# EAGLE schematic PreContV1 (EAGLE 6.1)
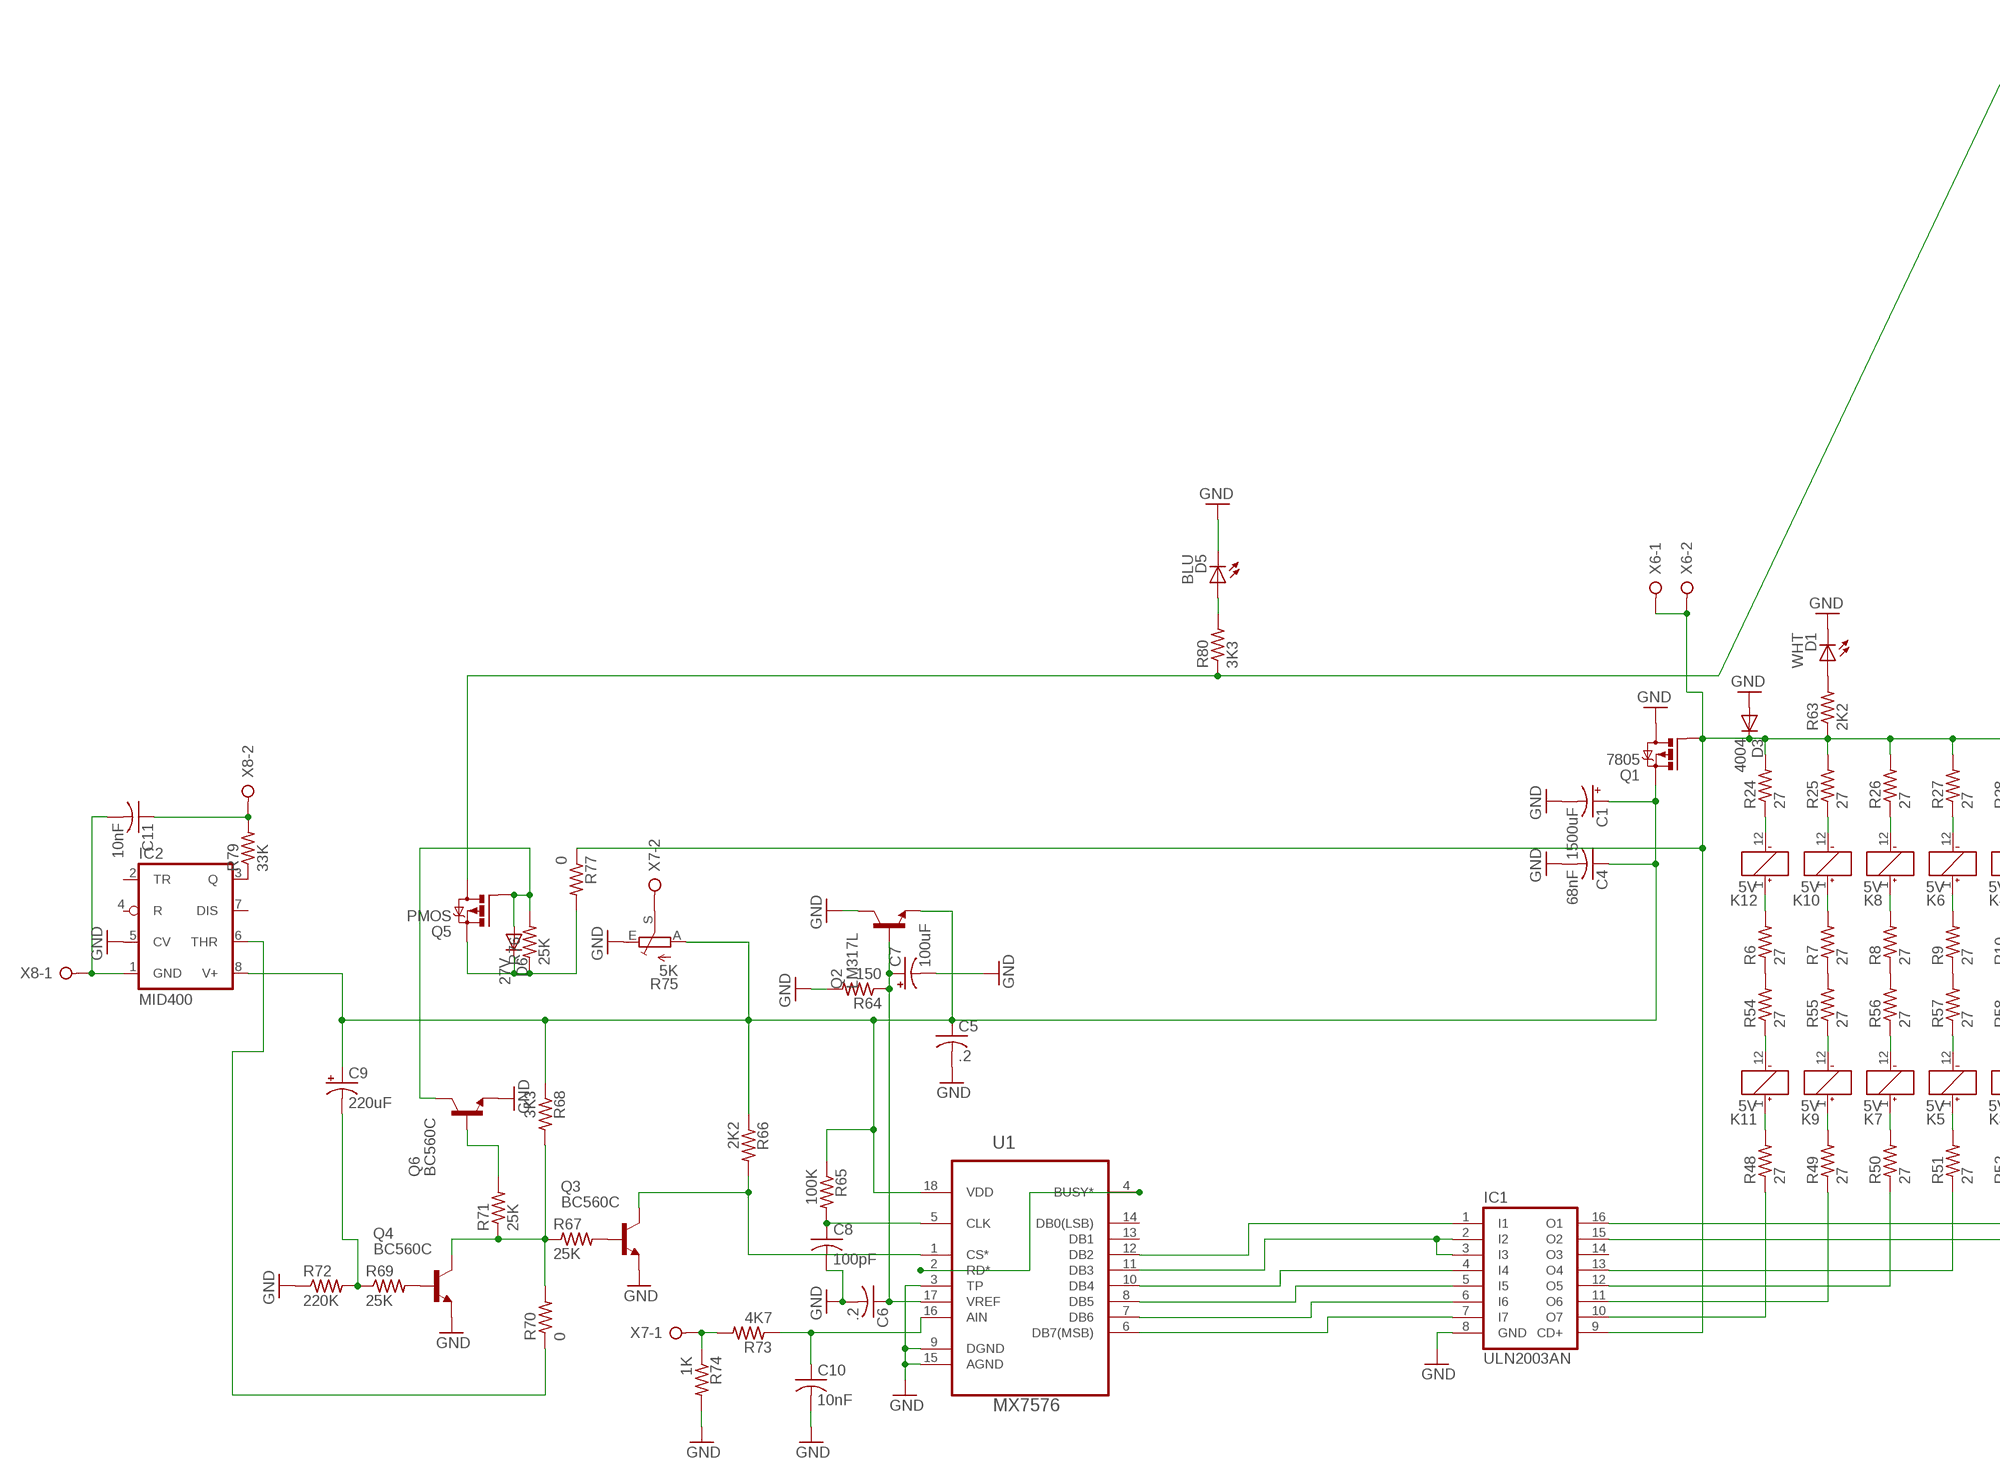
[diagram p0: schematic, sheet 1, part 1 of 2]
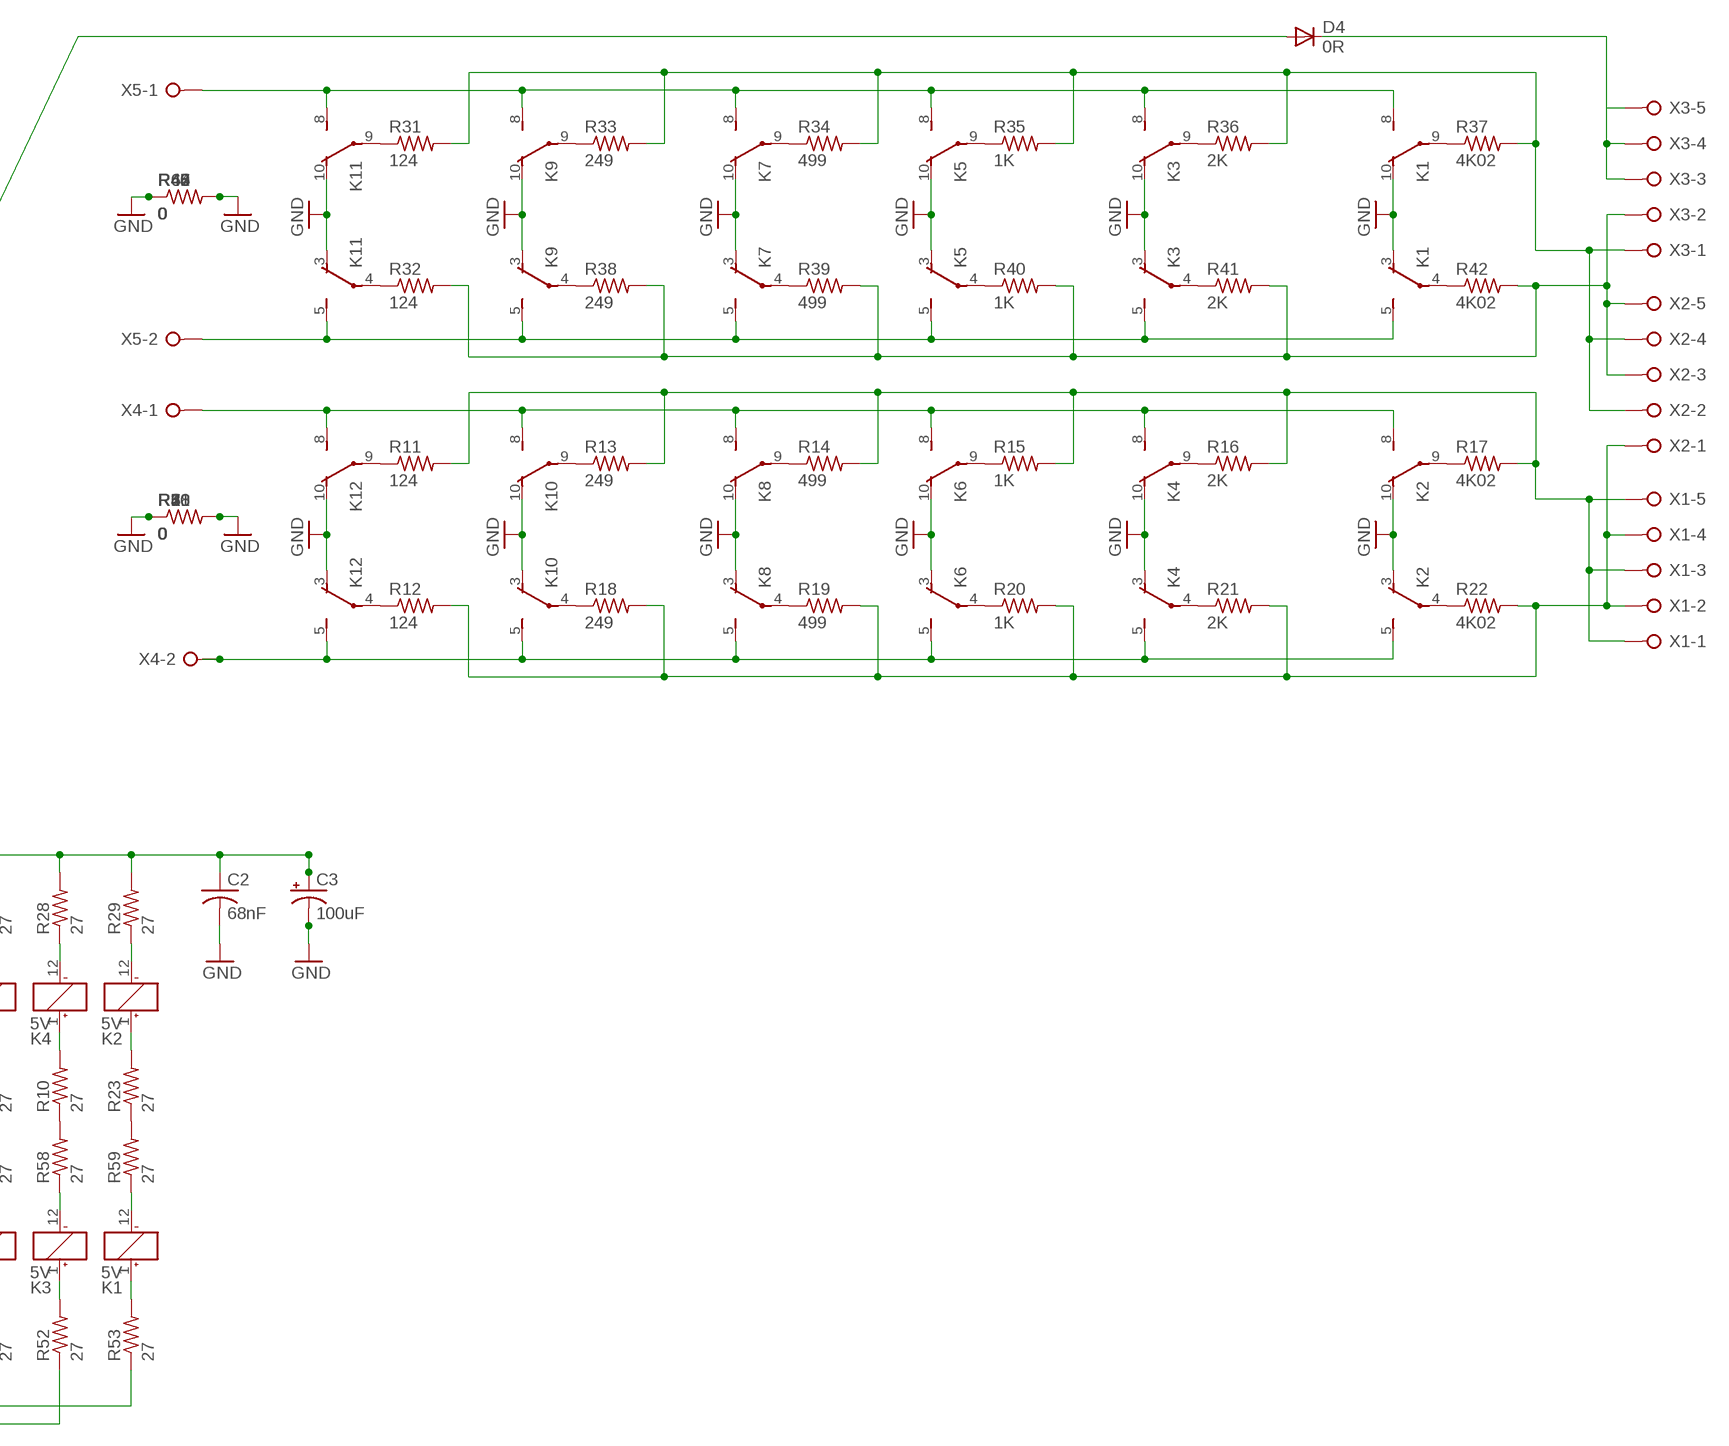
[diagram p1: schematic, sheet 1, part 2 of 2]

## Parts
C1  1500uF  CPOL-USE5-10.5  [E5-10,5]
C2  68nF  C-US075-042X103  [C075-042X103]
C3  100uF  CPOL-USE5-10.5  [E5-10,5]
C4  68nF  C-US075-042X103  [C075-042X103]
C5  .2  C-USC1210K  [C1210K]
C6  .2  C-USC1210K  [C1210K]
C7  100uF  CPOL-USE5-10.5  [E5-10,5]
C8  100pF  C-US050-075X075  [C050-075X075]
C9  220uF  CPOL-USE5-10.5  [E5-10,5]
C10  10nF  C-US050-075X075  [C050-075X075]
C11  10nF  C-US075-042X103  [C075-042X103]
D1  WHT  SFH482  [SFH482]
D3  4004  1N4148DO35-10  [DO35-10]
D4  0R  1N4148DO35-10  [DO35-10]
D5  BLU  SFH482  [SFH482]
D6  27V  1N4148DO35-7  [DO35-7]
IC1  ULN2003AN  [DIL16]
IC2  MID400  LM555N  [DIL08]
K1  5V  TX2-12V  [TX2]
K2  5V  TX2-12V  [TX2]
K3  5V  TX2-12V  [TX2]
K4  5V  TX2-12V  [TX2]
K5  5V  TX2-12V  [TX2]
K6  5V  TX2-12V  [TX2]
K7  5V  TX2-12V  [TX2]
K8  5V  TX2-12V  [TX2]
K9  5V  TX2-12V  [TX2]
K10  5V  TX2-12V  [TX2]
K11  5V  TX2-12V  [TX2]
K12  5V  TX2-12V  [TX2]
Q1  7805  IRF4905  [TO220BH]
Q2  LM317L  BC550B  [TO92-EBC]
Q3  BC560C  BC550B  [TO92-EBC]
Q4  BC560C  BC550B  [TO92-EBC]
Q5  PMOS  IRF4905  [TO220BH]
Q6  BC560C  BC550B  [TO92-EBC]
R1  0  R-US_0207/10  [0207/10]
R2  0  R-US_0207/10  [0207/10]
R3  0  R-US_0207/10  [0207/10]
R4  0  R-US_0207/10  [0207/10]
R5  0  R-US_0207/10  [0207/10]
R6  27  R-US_0207/10  [0207/10]
R7  27  R-US_0207/10  [0207/10]
R8  27  R-US_0207/10  [0207/10]
R9  27  R-US_0207/10  [0207/10]
R10  27  R-US_0207/10  [0207/10]
R11  124  R-US_0207/10  [0207/10]
R12  124  R-US_0207/10  [0207/10]
R13  249  R-US_0207/10  [0207/10]
R14  499  R-US_0207/10  [0207/10]
R15  1K  R-US_0207/10  [0207/10]
R16  2K  R-US_0207/10  [0207/10]
R17  4K02  R-US_0207/10  [0207/10]
R18  249  R-US_0207/10  [0207/10]
R19  499  R-US_0207/10  [0207/10]
R20  1K  R-US_0207/10  [0207/10]
R21  2K  R-US_0207/10  [0207/10]
R22  4K02  R-US_0207/10  [0207/10]
R23  27  R-US_0207/10  [0207/10]
R24  27  R-US_0207/10  [0207/10]
R25  27  R-US_0207/10  [0207/10]
R26  27  R-US_0207/10  [0207/10]
R27  27  R-US_0207/10  [0207/10]
R28  27  R-US_0207/10  [0207/10]
R29  27  R-US_0207/10  [0207/10]
R30  0  R-US_0207/10  [0207/10]
R31  124  R-US_0207/10  [0207/10]
R32  124  R-US_0207/10  [0207/10]
R33  249  R-US_0207/10  [0207/10]
R34  499  R-US_0207/10  [0207/10]
R35  1K  R-US_0207/10  [0207/10]
R36  2K  R-US_0207/10  [0207/10]
R37  4K02  R-US_0207/10  [0207/10]
R38  249  R-US_0207/10  [0207/10]
R39  499  R-US_0207/10  [0207/10]
R40  1K  R-US_0207/10  [0207/10]
R41  2K  R-US_0207/10  [0207/10]
R42  4K02  R-US_0207/10  [0207/10]
R43  0  R-US_0207/10  [0207/10]
R44  0  R-US_0207/10  [0207/10]
R45  0  R-US_0207/10  [0207/10]
R46  0  R-US_0207/10  [0207/10]
R47  0  R-US_0207/10  [0207/10]
R48  27  R-US_0207/10  [0207/10]
R49  27  R-US_0207/10  [0207/10]
R50  27  R-US_0207/10  [0207/10]
R51  27  R-US_0207/10  [0207/10]
R52  27  R-US_0207/10  [0207/10]
R53  27  R-US_0207/10  [0207/10]
R54  27  R-US_0207/12  [0207/12]
R55  27  R-US_0207/12  [0207/12]
R56  27  R-US_0207/12  [0207/12]
R57  27  R-US_0207/12  [0207/12]
R58  27  R-US_0207/12  [0207/12]
R59  27  R-US_0207/10  [0207/10]
R60  0  R-US_0207/10  [0207/10]
R61  0  R-US_0207/10  [0207/10]
R62  0  R-US_0207/10  [0207/10]
R63  2K2  R-US_0309/12  [0309/12]
R64  150  R-US_0207/10  [0207/10]
R65  100K  R-US_0207/10  [0207/10]
R66  2K2  R-US_0207/10  [0207/10]
R67  25K  R-US_0207/10  [0207/10]
R68  3K3  R-US_0207/10  [0207/10]
R69  25K  R-US_0207/10  [0207/10]
R70  0  R-US_0207/10  [0207/10]
R71  25K  R-US_0207/10  [0207/10]
R72  220K  R-US_0207/10  [0207/10]
R73  4K7  R-US_0207/10  [0207/10]
R74  1K  R-US_0207/10  [0207/10]
R75  5K  TRIM_EU-RJ9W  [RJ9W]
R76  25K  R-US_0207/10  [0207/10]
R77  0  R-US_0207/10  [0207/10]
R78  0  R-US_0207/10  [0207/10]
R79  33K  R-US_0309/12  [0309/12]
R80  3K3  R-US_0207/10  [0207/10]
U1  MX7576  AD7575JNZ  [DIP254P762X533-18P]
X1  W237-05P  [W237-5P]
X2  W237-05P  [W237-5P]
X3  W237-05P  [W237-5P]
X4  W237-02P  [W237-132]
X5  W237-02P  [W237-132]
X6  W237-02P  [W237-132]
X7  W237-02P  [W237-132]
X8  W237-02P  [W237-132]

## Nets
GND: C1.- C2.2 C3.- C4.2 C5.2 C6.2 C7.- C8.2 C10.2 D1.K(C) D3.A D5.K(C) IC1.8(GND) IC2.5(CV) K1.3(1:O) K1.10(2:O) K2.3(1:O) K2.10(2:O) K3.3(1:O) K3.10(2:O) K4.3(1:O) K4.10(2:O) K5.3(1:O) K5.10(2:O) K6.3(1:O) K6.10(2:O) K7.3(1:O) K7.10(2:O) K8.3(1:O) K8.10(2:O) K9.3(1:O) K9.10(2:O) K10.3(1:O) K10.10(2:O) K11.3(1:O) K11.10(2:O) K12.3(1:O) K12.10(2:O) Q1.D Q2.C Q3.E Q4.E Q6.E R1.1 R1.2 R2.1 R2.2 R3.1 R3.2 R4.1 R4.2 R5.1 R5.2 R30.1 R30.2 R43.1 R43.2 R44.1 R44.2 R45.1 R45.2 R46.1 R46.2 R47.1 R47.2 R60.1 R60.2 R61.1 R61.2 R62.1 R62.2 R64.2 R72.1 R74.2 R75.E R78.1 R78.2 U1.3(TP) U1.9(DGND) U1.15(AGND)
N$1: D4.A Q5.D R80.1
N$2: R32.2 R38.2 R39.2 R40.2 R41.2 R42.2 X2.3 X2.5 X3.2
N$3: R31.2 R33.2 R34.2 R35.2 R36.2 R37.2 X2.2 X2.4 X3.1
N$4: K1.8(2:S) K3.8(2:S) K5.8(2:S) K7.8(2:S) K9.8(2:S) K11.8(2:S) X5.1
N$5: K1.5(1:S) K3.5(1:S) K5.5(1:S) K7.5(1:S) K9.5(1:S) K11.5(1:S) X5.2
N$6: K11.9(2:P) R31.1
N$7: K11.4(1:P) R32.1
N$8: K2.8(2:S) K4.8(2:S) K6.8(2:S) K8.8(2:S) K10.8(2:S) K12.8(2:S) X4.1
N$9: K2.5(1:S) K4.5(1:S) K6.5(1:S) K8.5(1:S) K10.5(1:S) K12.5(1:S) X4.2
N$10: R12.2 R18.2 R19.2 R20.2 R21.2 R22.2 X1.2 X1.4 X2.1
N$11: K12.1(_:+) R6.2
N$12: K10.1(_:+) R7.2
N$13: K8.1(_:+) R8.2
N$14: K6.1(_:+) R9.2
N$15: R11.2 R13.2 R14.2 R15.2 R16.2 R17.2 X1.1 X1.3 X1.5
N$16: K4.1(_:+) R10.2
N$17: K2.1(_:+) R23.2
N$18: K12.12(_:-) R24.1
N$19: K10.12(_:-) R25.1
N$20: K12.9(2:P) R11.1
N$21: K12.4(1:P) R12.1
N$22: K10.9(2:P) R13.1
N$23: K8.9(2:P) R14.1
N$24: K6.9(2:P) R15.1
N$25: K2.9(2:P) R17.1
N$26: K4.9(2:P) R16.1
N$27: K10.4(1:P) R18.1
N$28: K8.4(1:P) R19.1
N$29: K6.4(1:P) R20.1
N$30: K4.4(1:P) R21.1
N$31: K2.4(1:P) R22.1
N$32: K8.12(_:-) R26.1
N$33: K6.12(_:-) R27.1
N$34: K4.12(_:-) R28.1
N$35: K2.12(_:-) R29.1
N$36: C2.1 C3.+ D3.C IC1.9(CD+) Q1.G R24.2 R25.2 R26.2 R27.2 R28.2 R29.2 R63.1 R77.1 X6.1 X6.2
N$37: K9.9(2:P) R33.1
N$38: K7.9(2:P) R34.1
N$39: K5.9(2:P) R35.1
N$40: K1.9(2:P) R37.1
N$41: K3.9(2:P) R36.1
N$42: K9.4(1:P) R38.1
N$43: K7.4(1:P) R39.1
N$44: K5.4(1:P) R40.1
N$45: K3.4(1:P) R41.1
N$46: K1.4(1:P) R42.1
N$47: K11.1(_:+) R48.2
N$48: K9.1(_:+) R49.2
N$49: K7.1(_:+) R50.2
N$50: K5.1(_:+) R51.2
N$51: K3.1(_:+) R52.2
N$52: K1.1(_:+) R53.2
N$53: K11.12(_:-) R54.1
N$54: K9.12(_:-) R55.1
N$55: K7.12(_:-) R56.1
N$56: K5.12(_:-) R57.1
N$57: K3.12(_:-) R58.1
N$58: K1.12(_:-) R59.1
N$59: R6.1 R54.2
N$60: IC1.10(O7) R48.1
N$61: IC1.11(O6) R49.1
N$62: R7.1 R55.2
N$63: R8.1 R56.2
N$64: R9.1 R57.2
N$65: R10.1 R58.2
N$66: R23.1 R59.2
N$67: IC1.12(O5) R50.1
N$68: IC1.13(O4) R51.1
N$69: IC1.15(O2) R52.1
N$70: IC1.16(O1) R53.1
N$71: IC1.7(I7) U1.6(DB7(MSB))
N$72: IC1.6(I6) U1.7(DB6)
N$73: IC1.5(I5) U1.8(DB5)
N$74: IC1.4(I4) U1.10(DB4)
N$75: IC1.2(I2) IC1.3(I3) U1.11(DB3)
N$76: IC1.1(I1) U1.12(DB2)
N$77: U1.2(RD*) U1.4(BUSY*)
N$78: C1.+ C4.1 C5.1 C9.+ IC2.8(V+) Q1.S Q2.E R65.1 R66.1 R68.1 R75.A U1.18(VDD)
N$79: D1.A R63.2
N$80: C6.1 C7.+ Q2.B R64.1 U1.17(VREF)
N$81: Q3.C R66.2 U1.1(CS*)
N$82: C8.1 R65.2 U1.5(CLK)
N$83: Q6.B R71.2
N$84: C10.1 R73.1 U1.16(AIN)
N$85: Q3.B R67.2
N$86: Q4.C R67.1 R68.2 R70.2 R71.1
N$87: Q4.B R69.2
N$88: C9.- R69.1 R72.2
N$89: R73.2 R74.1 X7.1
N$90: R75.S X7.2
N$91: D6.A Q5.G Q6.C R76.2
N$92: IC2.6(THR) R70.1
N$93: C11.2 IC2.1(GND) X8.1
N$94: IC2.3(Q) R79.1
N$95: D6.C Q5.S R76.1 R77.2
N$96: D4.C X3.3 X3.4 X3.5
N$97: C11.1 R79.2 X8.2
N$98: D5.A R80.2
Unconnected: IC1.14(O3) IC2.2(TR) IC2.4(R) IC2.7(DIS) U1.13(DB1) U1.14(DB0(LSB))

## Library data of the parts
C1 C3 C7 C9 = resistor:CPOL-US: POLARIZED CAPACITOR, American symbol
C2 C4-C6 C8 C10 C11 = resistor:C-US: CAPACITOR, American symbol
D1 D5 = led:SFH482: IR LED infrared emitting diode, Infineon
D3 D4 D6 = diode:1N4148: DIODE high speed (Philips)
IC1 = uln-udn:ULN2003A: DRIVER ARRAY
IC2 = linear:*555: TIMER
K1-K12 = relay:TX2?-*: 2 AMP. HIGH CAPACITY RELAY NAiS WITH HIGH SURGE VOLTAGE & HIGH BREAKDOWN VOLTAGE Source: http://www.mew-europe.com/.. en_ds_61022_0001.pdf; MF: AROMAT/ MATSUSHITA; MPN: TX2-12V; OC_FARNELL: 1200952; OC_NEWARK: 67K1295
Q1 Q5 = transistor-power:IRF4905: P-Channel HEXFET® Power MOSFET RDS(on)= 0.02 Ohm, ID = -74A Source: http://www.irf.com/product-info/datasheets/data/irf4905pbf.pdf
Q2-Q4 Q6 = transistor-npn:BC550*: NPN Transistor
R1-R74 R76-R80 = resistor:R-US_: RESISTOR, American symbol
R75 = pot:TRIM_EU-: POTENTIOMETER
U1 = ADI-Phase-2:AD7575JNZ: 8 Bit Analog-to-Digital Converters; MPN: AD7575JNZ; OC_FARNELL: 1079349; OC_NEWARK: 19M0875; PACKAGE: DIP-18; SUPPLIER: Analog Devices
X1-X3 = con-wago-508:W237-05P: WAGO SREW CLAMP; OC_FARNELL: unknown; OC_NEWARK: unknown
X4-X8 = con-wago-508:W237-02P: WAGO SREW CLAMP; OC_FARNELL: unknown; OC_NEWARK: unknown